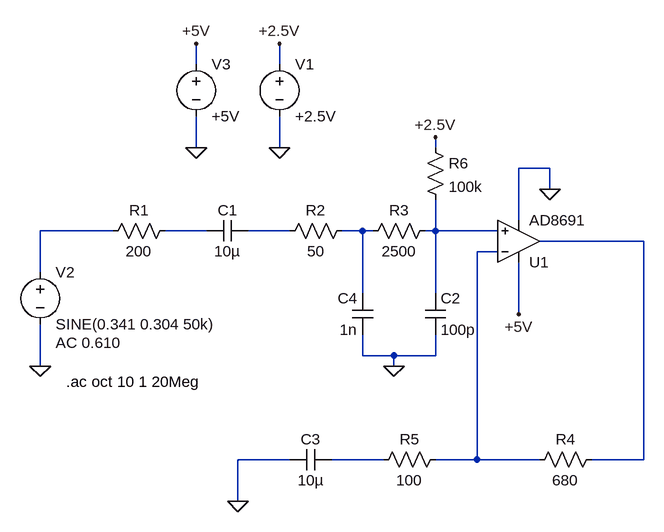
[diagram p0: schematic DDS FILTER.asc]
DDS FILTER.asc, the LTspice schematic file:
Version 4
SHEET 1 880 680
WIRE -240 -128 -240 -160
WIRE -112 -128 -112 -160
WIRE -240 0 -240 -48
WIRE -112 0 -112 -48
WIRE 128 0 128 -16
WIRE 304 32 256 32
WIRE 304 64 304 32
WIRE 256 112 256 32
WIRE -368 128 -480 128
WIRE -224 128 -288 128
WIRE -96 128 -160 128
WIRE 16 128 -16 128
WIRE 32 128 16 128
WIRE 128 128 128 80
WIRE 128 128 112 128
WIRE 224 128 128 128
WIRE 448 144 288 144
WIRE 224 160 192 160
WIRE -480 192 -480 128
WIRE 16 224 16 128
WIRE 128 224 128 128
WIRE 256 256 256 176
WIRE 16 320 16 288
WIRE 64 320 16 320
WIRE 128 320 128 288
WIRE 128 320 64 320
WIRE -480 336 -480 272
WIRE 64 336 64 320
WIRE -96 480 -176 480
WIRE 48 480 -32 480
WIRE 192 480 192 160
WIRE 192 480 128 480
WIRE 288 480 192 480
WIRE 448 480 448 144
WIRE 448 480 368 480
WIRE -176 544 -176 480
FLAG -480 336 0
FLAG 304 64 0
FLAG -176 544 0
FLAG -240 0 0
FLAG -240 -160 +5V
FLAG -112 0 0
FLAG -112 -160 +2.5V
FLAG 64 336 0
FLAG 256 256 +5V
FLAG 128 -16 +2.5V
SYMBOL OpAmps\\AD8691 256 208 M180
SYMATTR InstName U1
SYMBOL voltage -112 -144 R0
WINDOW 123 0 0 Left 0
WINDOW 39 0 0 Left 0
SYMATTR InstName V1
SYMATTR Value +2.5V
SYMBOL voltage -480 176 R0
WINDOW 123 24 124 Left 2
WINDOW 39 0 0 Left 0
SYMATTR Value2 AC 0.610
SYMATTR InstName V2
SYMATTR Value SINE(0.341 0.304 50k)
SYMBOL res -272 112 R90
WINDOW 0 0 56 VBottom 2
WINDOW 3 32 56 VTop 2
SYMATTR InstName R1
SYMATTR Value 200
SYMBOL cap -160 112 R90
WINDOW 0 0 32 VBottom 2
WINDOW 3 32 32 VTop 2
SYMATTR InstName C1
SYMATTR Value 10µ
SYMBOL res 0 112 R90
WINDOW 0 0 56 VBottom 2
WINDOW 3 32 56 VTop 2
SYMATTR InstName R2
SYMATTR Value 50
SYMBOL res 128 112 R90
WINDOW 0 0 56 VBottom 2
WINDOW 3 32 56 VTop 2
SYMATTR InstName R3
SYMATTR Value 2500
SYMBOL cap 112 224 R0
SYMATTR InstName C2
SYMATTR Value 100p
SYMBOL voltage -240 -144 R0
WINDOW 123 0 0 Left 0
WINDOW 39 0 0 Left 0
SYMATTR InstName V3
SYMATTR Value +5V
SYMBOL res 384 464 R90
WINDOW 0 0 56 VBottom 2
WINDOW 3 32 56 VTop 2
SYMATTR InstName R4
SYMATTR Value 680
SYMBOL res 144 464 R90
WINDOW 0 0 56 VBottom 2
WINDOW 3 32 56 VTop 2
SYMATTR InstName R5
SYMATTR Value 100
SYMBOL cap -32 464 R90
WINDOW 0 0 32 VBottom 2
WINDOW 3 32 32 VTop 2
SYMATTR InstName C3
SYMATTR Value 10µ
SYMBOL cap 32 288 R180
WINDOW 0 24 56 Left 2
WINDOW 3 24 8 Left 2
SYMATTR InstName C4
SYMATTR Value 1n
SYMBOL res 112 -16 R0
SYMATTR InstName R6
SYMATTR Value 100k
TEXT -440 360 Left 2 !.ac oct 10 1 20Meg

The netlist it stands for:
* DDS FILTER.asc
XU1 N005 N007 +5V 0 N006 AD8691  ; pins In+ In- V+ V- OUT
V1 +2.5V 0 +2.5V
V2 N001 0 SINE(0.341 0.304 50k) AC 0.610
R1 N002 N001 200
C1 N003 N002 10µ
R2 N004 N003 50
R3 N005 N004 2500
C2 N005 0 100p
V3 +5V 0 +5V
R4 N006 N007 680
R5 N007 N008 100
C3 N008 0 10µ
C4 0 N004 1n
R6 +2.5V N005 100k
.ac oct 10 1 20Meg
.backanno
.end